# EAGLE design droracer615_104 (EAGLE 9.6.2)
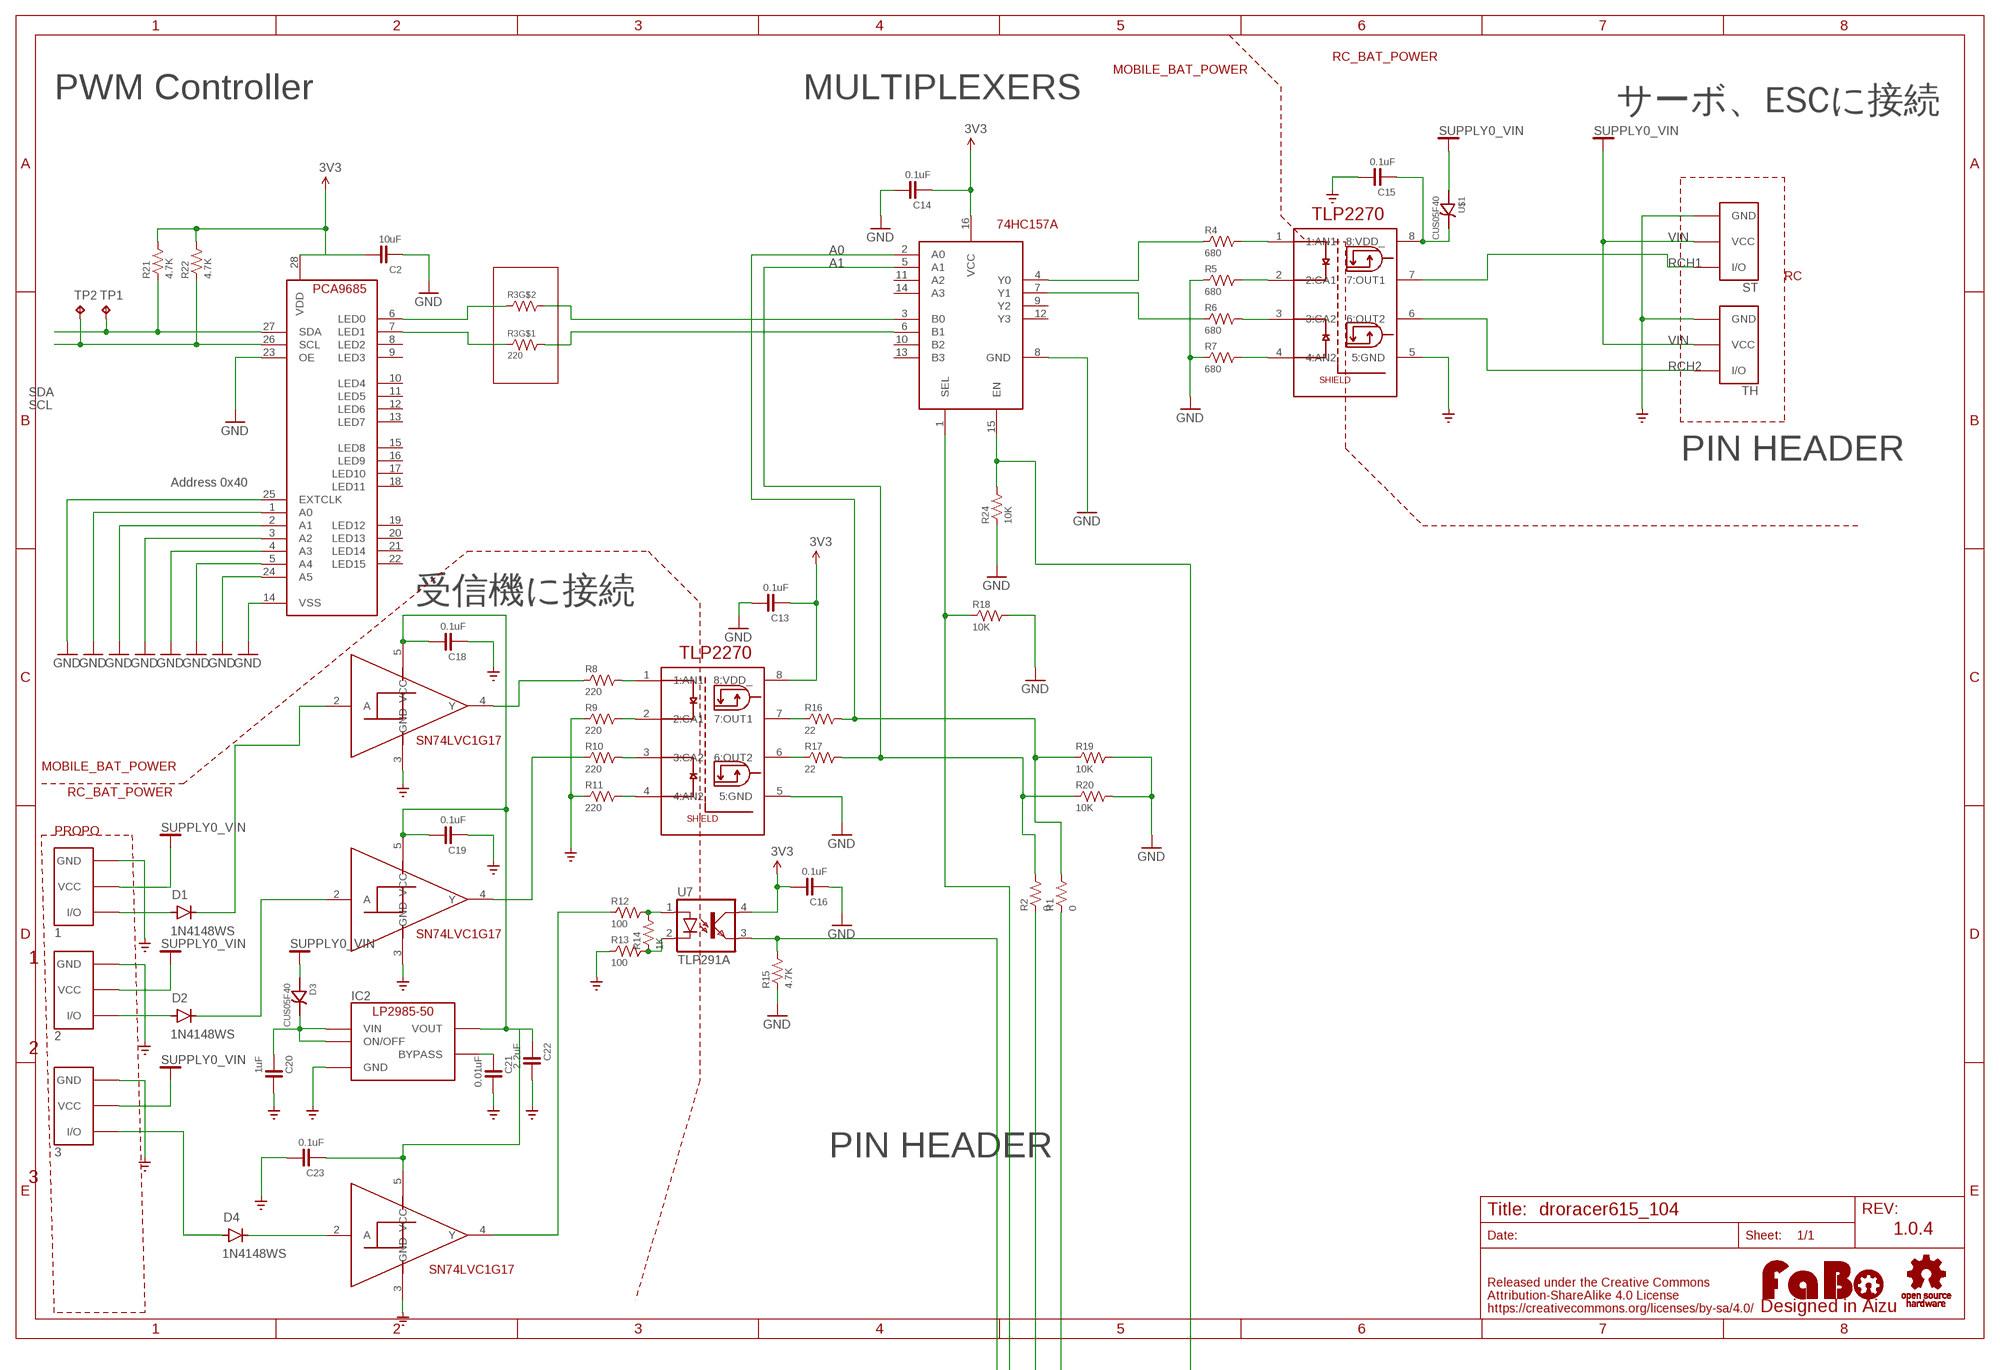
[diagram p0: schematic, sheet 1, part 1 of 2]
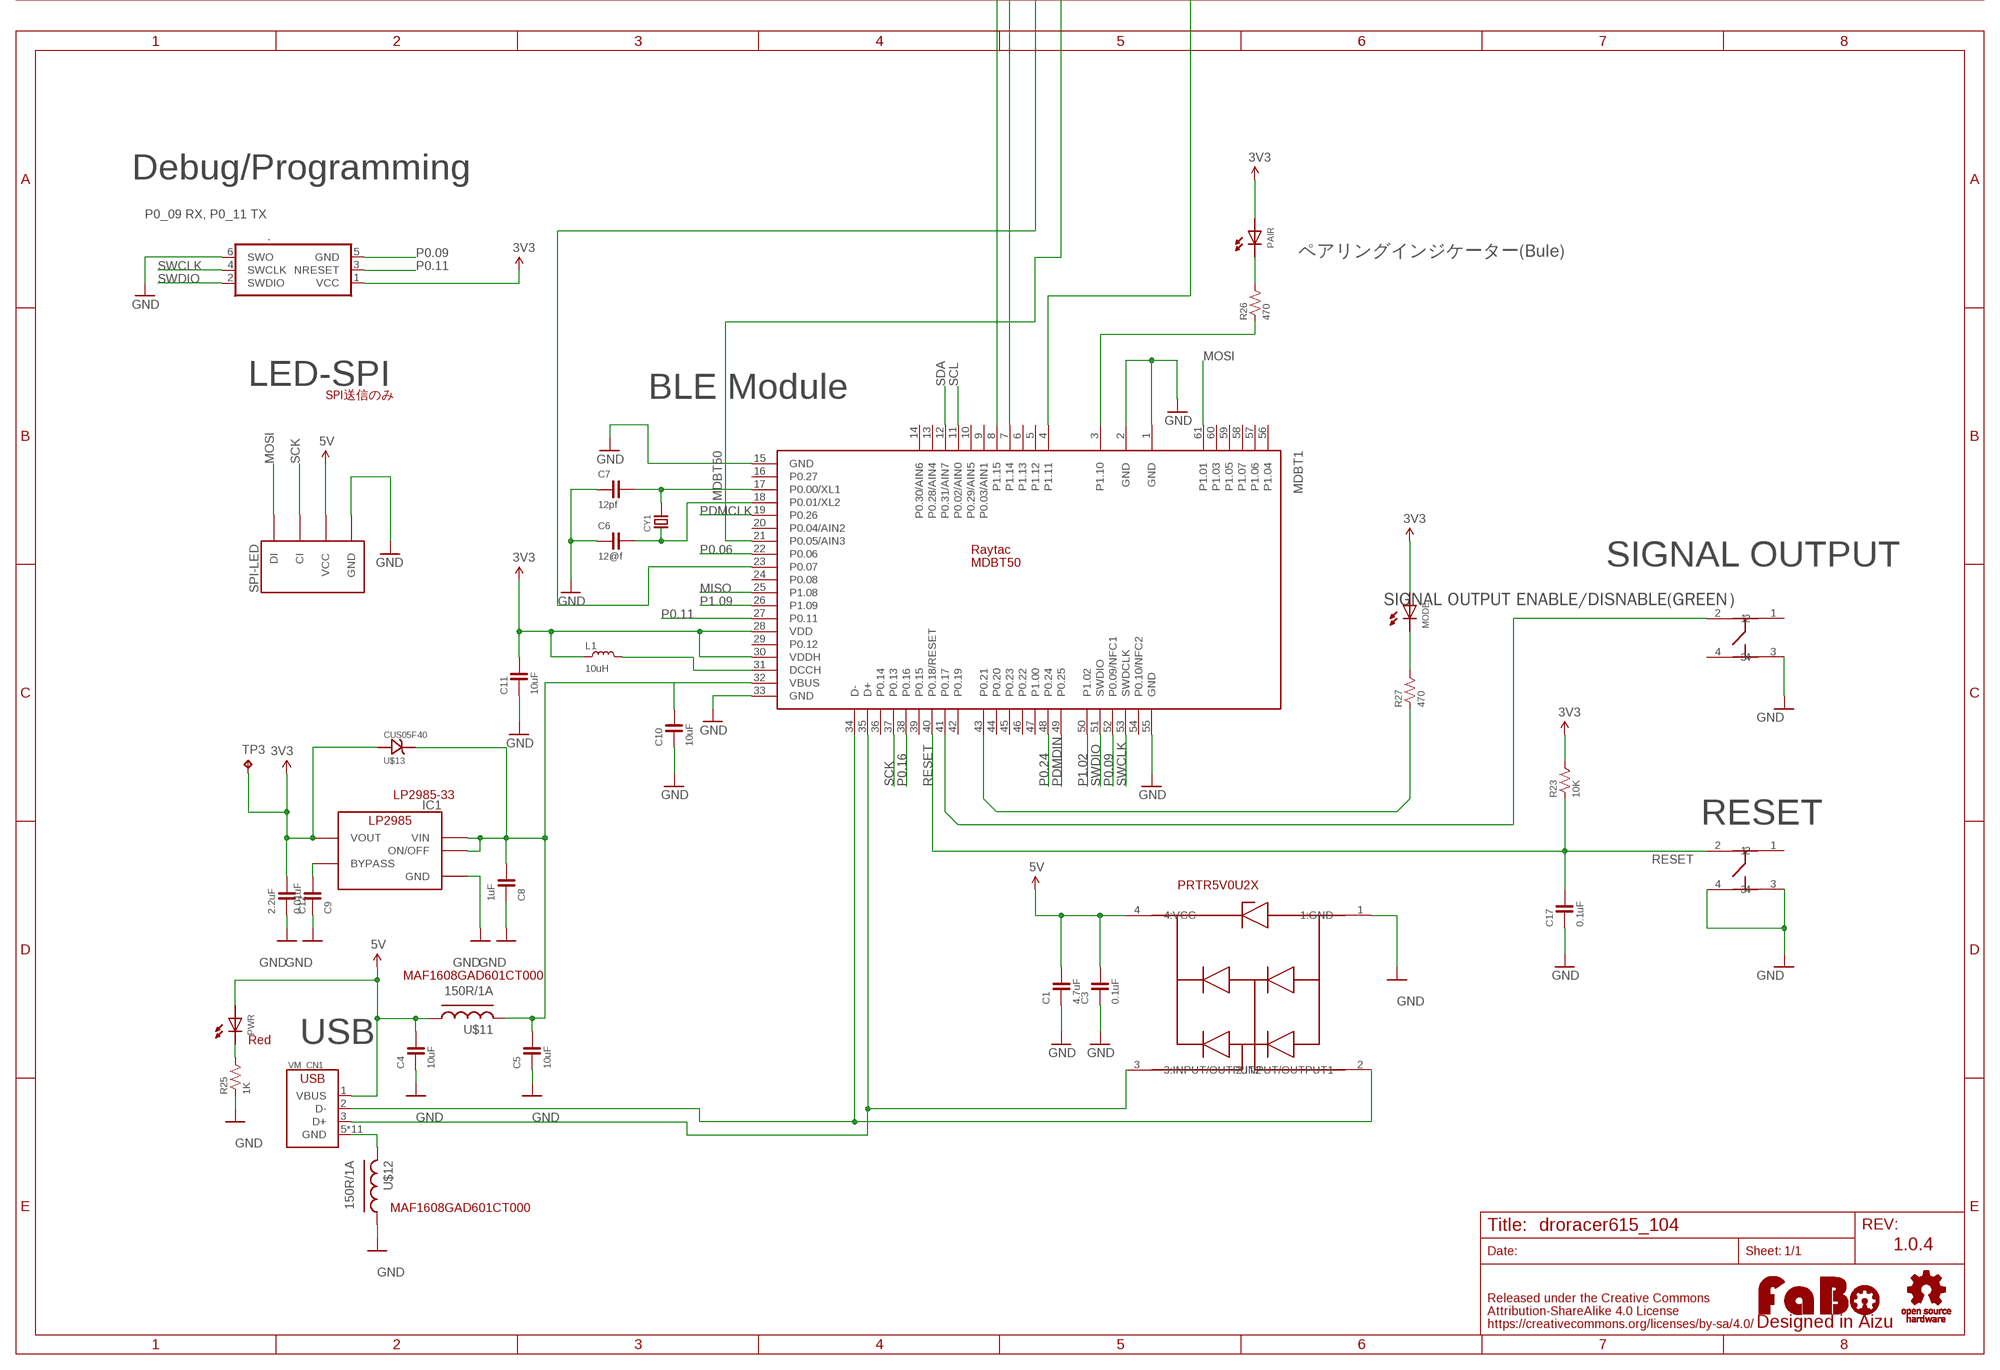
[diagram p1: schematic, sheet 1, part 2 of 2]

## Parts
1  FABO_BRICK_3PIN-HEADER  [FABO_BRICK_3PIN_HEADER]
2  FABO_BRICK_3PIN-HEADER  [FABO_BRICK_3PIN_HEADER]
3  FABO_BRICK_3PIN-HEADER  [FABO_BRICK_3PIN_HEADER]
.  TC2030-IDC-NL  [TC2030-IDC-NL]
C1  4.7uF  CAPACITOR-0603  [0603]
C2  10uF  CAPACITOR-0603  [0603]
C3  0.1uF  CAPACITOR-0603  [0603]
C4  10uF  CAPACITOR-0603  [0603]
C5  10uF  CAPACITOR-0603  [0603]
C6  12@f  CAPACITOR-0603  [0603]
C7  12pf  CAPACITOR-0603  [0603]
C8  1uF  CAPACITOR-0603  [0603]
C9  0.01uF  CAPACITOR-0603  [0603]
C10  10uF  CAPACITOR-0603  [0603]
C11  10uF  CAPACITOR-0603  [0603]
C12  2.2uF  CAPACITOR-0603  [0603]
C13  0.1uF  CAPACITOR-0603  [0603]
C14  0.1uF  CAPACITOR-0603  [0603]
C15  0.1uF  CAPACITOR-0603  [0603]
C16  0.1uF  CAPACITOR-0603  [0603]
C17  0.1uF  CAPACITOR-0603  [0603]
C18  0.1uF  CAPACITOR-0603  [0603]
C19  0.1uF  CAPACITOR-0603  [0603]
C20  1uF  CAPACITOR-0603  [0603]
C21  0.01uF  CAPACITOR-0603  [0603]
C22  2.2uF  CAPACITOR-0603  [0603]
C23  0.1uF  CAPACITOR-0603  [0603]
CY1  CRYSTAL-ABS07  [ABRACON-ABS07-32.768KHZ]
D1  1N4148WS  [SOD-323]
D2  1N4148WS  [SOD-323]
D3  CUS05F40  [CUS05F40]
D4  1N4148WS  [SOD-323]
IC1  LP2985-33DBV  [SOT-23-5]
IC2  LP2985-50  [SOT-23-5]
L1  10uH  COIL-0603  [0603]
LOGO3  LOGO_FABO-S  [LOGO_FABO_S]
MDBT1  MDBT50  [MDBT50]
MODE  LED-0603-NARROW  [0603-NARROW]
PAIR  LED-0603-NARROW  [0603-NARROW]
PWR  LED-0603-NARROW  [0603-NARROW]
R1  0  RESISTOR-0603-NARROW  [0603-NARROW]
R2  0  RESISTOR-0603-NARROW  [0603-NARROW]
R3  220  RESISTOR_ARRAY  [EXBV8V]
R4  680  RESISTOR-0603-NARROW  [0603-NARROW]
R5  680  RESISTOR-0603-NARROW  [0603-NARROW]
R6  680  RESISTOR-0603-NARROW  [0603-NARROW]
R7  680  RESISTOR-0603-NARROW  [0603-NARROW]
R8  220  RESISTOR-0603-NARROW  [0603-NARROW]
R9  220  RESISTOR-0603-NARROW  [0603-NARROW]
R10  220  RESISTOR-0603-NARROW  [0603-NARROW]
R11  220  RESISTOR-0603-NARROW  [0603-NARROW]
R12  100  RESISTOR-0603-NARROW  [0603-NARROW]
R13  100  RESISTOR-0603-NARROW  [0603-NARROW]
R14  1K  RESISTOR-0603-NARROW  [0603-NARROW]
R15  4.7K  RESISTOR-0603-NARROW  [0603-NARROW]
R16  22  RESISTOR-0603-NARROW  [0603-NARROW]
R17  22  RESISTOR-0603-NARROW  [0603-NARROW]
R18  10K  RESISTOR-0603-NARROW  [0603-NARROW]
R19  10K  RESISTOR-0603-NARROW  [0603-NARROW]
R20  10K  RESISTOR-0603-NARROW  [0603-NARROW]
R21  4.7K  RESISTOR-0603-NARROW  [0603-NARROW]
R22  4.7K  RESISTOR-0603-NARROW  [0603-NARROW]
R23  10K  RESISTOR-0603-NARROW  [0603-NARROW]
R24  10K  RESISTOR-0603-NARROW  [0603-NARROW]
R25  1K  RESISTOR-0603-NARROW  [0603-NARROW]
R26  470  RESISTOR-0603-NARROW  [0603-NARROW]
R27  470  RESISTOR-0603-NARROW  [0603-NARROW]
SPI-LED  FABO-SPI-LED  [SPI-B04B-PASK-1_2]
ST  FABO_BRICK_3PIN-HEADER  [FABO_BRICK_3PIN_HEADER]
TH  FABO_BRICK_3PIN-HEADER  [FABO_BRICK_3PIN_HEADER]
TP1  TPB0,65  [B0,65]
TP2  TPB0,65  [B0,65]
TP3  TPB0,65  [B0,65]
U7  TLP291A  [11-3C1]
U$1  CUS05F40  [CUS05F40]
U$2  PCA9685  [PCA9685]
U$3  MULTIPLEXERSMC74HC157A  [TSSOP-16]
U$5  SWICTH-4P(KMR2)  [SWITCH-4P(KMR2)]
U$8  SN74LVC1G17  [SOT-23]
U$10  PRTR5V0U2X  [SOT-143B]
U$11  150R/1A  FERRITECHIPBEADS_0603_M  [RESC0603_M]
U$12  150R/1A  FERRITECHIPBEADS_0603_M  [RESC0603_M]
U$13  CUS05F40  [CUS05F40]
U$14  SN74LVC1G17  [SOT-23]
U$15  TLP2270  [TLP2270]
U$16  TLP2270  [TLP2270]
U$17  SWICTH-4P(KMR2)  [SWITCH-4P(KMR2)]
U$18  SN74LVC1G17  [SOT-23]
U$19  LOGO_OSHW-M_BOTTOM  [LOGO_OSHW_M_BOTTOM]
VM_CN1  USB-ZX62D  [ZX62D-B-5PA8]

## Nets
3V3: ..1(VCC) C2.2 C11.2 C12.2 C13.1 C14.1 C16.2 IC1.5(VOUT) L1.1 MDBT1.28(VDD) MDBT1.30(VDDH) MODE.ANODE PAIR.ANODE R21.2 R22.2 R23.2 TP3.TP U7.4(COL) U$2.28(VDD) U$3.16(VCC) U$13.A(ANODE) U$16.8(8:VDD_)
5V: C1.2 C3.2 C4.2 PWR.ANODE SPI-LED.VCC U$10.4(4:VCC) U$11.1 VM_CN1.1(VBUS)
A0: R1.2 R16.2 R19.1 U$3.2(A0)
A1: R2.2 R17.2 R20.1 U$3.5(A1)
D4: MDBT1.8(P1.15) R15.2 U7.3(EMI)
D+: MDBT1.35(D+) U$10.3(3:INPUT/OUTPUT2) VM_CN1.3(D+)
D-: MDBT1.34(D-) U$10.2(2:INPUT/OUTPUT1) VM_CN1.2(D-)
GND: 1.GND 2.GND 3.GND C15.2 C18.1 C19.1 C20.2 C21.2 C22.2 C23.2 IC2.2(GND) R9.1 R11.1 R13.1 ST.GND TH.GND U$8.3(GND) U$14.3(GND) U$15.5(5:GND) U$18.3(GND) ; supply symbol labelled SUPPLY0_GND_
GND2: ..6(SWO) C1.1 C2.1 C3.1 C4.1 C5.1 C6.1 C7.1 C8.1 C9.1 C10.1 C11.1 C12.1 C13.2 C14.2 C16.1 C17.1 IC1.2(GND) MDBT1.1(GND) MDBT1.2(GND) MDBT1.15(GND) MDBT1.33(GND) MDBT1.55(GND) R5.1 R7.1 R15.1 R18.2 R19.2 R20.2 R24.1 R25.1 SPI-LED.GND U$2.1(A0) U$2.2(A1) U$2.3(A2) U$2.4(A3) U$2.5(A4) U$2.14(VSS) U$2.23(OE) U$2.24(A5) U$2.25(EXTCLK) U$3.8(GND) U$5.3 U$5.4 U$10.1(1:GND) U$12.1 U$16.5(5:GND) U$17.3 ; supply symbol labelled GND
MISO: MDBT1.25(P1.08)
MOSI: MDBT1.61(P1.01) SPI-LED.DI
N$2: R3.2 U$2.6(LED0)
N$3: R3.1 U$2.7(LED1)
N$4: U$12.2 VM_CN1.5(GND) VM_CN1.B1(GND) VM_CN1.B2(GND) VM_CN1.B3(GND) VM_CN1.B4(GND) VM_CN1.T1(GND) VM_CN1.T2(GND) VM_CN1.T3(GND) VM_CN1.T4(GND) VM_CN1.T5(GND) VM_CN1.T6(GND)
N$5: R4.2 U$15.1(1:AN1)
N$6: C9.2 IC1.4(BYPASS)
N$7: C15.1 U$1.C(CATHODE) U$15.8(8:VDD_)
N$8: C5.2 C8.2 C10.2 IC1.1(VIN) IC1.3(ON/OFF) MDBT1.32(VBUS) U$11.2 U$13.C(CATHODE)
N$9: R4.1 U$3.4(Y0)
N$10: D4.C U$8.2(A)
N$11: 3.I/O D4.A
N$12: R12.1 U$8.4(Y)
N$14: R6.1 U$3.7(Y1)
N$15: MDBT1.4(P1.11) R24.2 U$3.15(EN)
N$16: R5.2 U$15.2(2:CA1)
N$17: R6.2 U$15.3(3:CA2)
N$18: R7.2 U$15.4(4:AN2)
N$20: C7.2 CY1.P$2 MDBT1.17(P0.00/XL1)
N$21: C6.2 CY1.P$1 MDBT1.18(P0.01/XL2)
N$22: L1.2 MDBT1.31(DCCH)
N$23: R8.2 U$16.1(1:AN1)
N$24: R9.2 U$16.2(2:CA1)
N$25: R10.2 U$16.3(3:CA2)
N$26: R11.2 U$16.4(4:AN2)
N$27: D1.C U$18.2(A)
N$28: R10.1 U$14.4(Y)
N$29: R8.1 U$18.4(Y)
N$30: R12.2 R14.2 U7.1(A)
N$31: R13.2 R14.1 U7.2(C)
N$32: R16.1 U$16.7(7:OUT1)
N$33: R17.1 U$16.6(6:OUT2)
N$34: MDBT1.21(P0.05/AIN3) R1.1
N$35: MDBT1.7(P1.14) R18.1 U$3.1(SEL)
N$36: PWR.CATHODE R25.2
N$37: R3.7 U$3.3(B0)
N$38: R3.8 U$3.6(B1)
N$39: PAIR.CATHODE R26.2
N$40: MDBT1.3(P1.10) R26.1
N$41: MODE.CATHODE R27.2
N$42: MDBT1.41(P0.17) U$17.2
N$43: MDBT1.43(P0.21) R27.1
N$44: MDBT1.23(P0.07) R2.1
N$45: 1.I/O D1.A
N$46: 2.I/O D2.A
N$47: D2.C U$14.2(A)
N$49: C21.1 IC2.4(BYPASS)
N$50: C20.1 D3.C(CATHODE) IC2.1(VIN) IC2.3(ON/OFF)
N$51: C18.2 C19.2 C22.1 C23.1 IC2.5(VOUT) U$8.5(VCC) U$14.5(VCC) U$18.5(VCC)
P0.06: MDBT1.22(P0.06)
P0.09: ..5(GND) MDBT1.52(P0.09/NFC1)
P0.11: ..3(NRESET) MDBT1.27(P0.11)
P0.16: MDBT1.38(P0.16)
P0.24: MDBT1.48(P0.24)
P1.02: MDBT1.50(P1.02)
P1.09: MDBT1.26(P1.09)
PDMCLK: MDBT1.19(P0.26)
PDMDIN: MDBT1.49(P0.25)
RCH1: ST.I/O U$15.7(7:OUT1)
RCH2: TH.I/O U$15.6(6:OUT2)
RESET: C17.2 MDBT1.40(P0.18/RESET) R23.1 U$5.2
SCK: MDBT1.37(P0.13) SPI-LED.CI
SCL: MDBT1.11(P0.02/AIN0) R22.1 TP2.TP U$2.26(SCL)
SDA: MDBT1.12(P0.31/AIN7) R21.1 TP1.TP U$2.27(SDA)
SWCLK: ..4(SWCLK) MDBT1.53(SWDCLK)
SWDIO: ..2(SWDIO) MDBT1.51(SWDIO)
VIN: 1.VCC 2.VCC 3.VCC D3.A(ANODE) ST.VCC TH.VCC U$1.A(ANODE) ; supply symbol labelled SUPPLY0_VIN
Unconnected: MDBT1.5(P1.12) MDBT1.6(P1.13) MDBT1.9(P0.03/AIN1) MDBT1.10(P0.29/AIN5) MDBT1.13(P0.28/AIN4) MDBT1.14(P0.30/AIN6) MDBT1.16(P0.27) MDBT1.20(P0.04/AIN2) MDBT1.24(P0.08) MDBT1.29(P0.12) MDBT1.36(P0.14) MDBT1.39(P0.15) MDBT1.42(P0.19) MDBT1.44(P0.20) MDBT1.45(P0.23) MDBT1.46(P0.22) MDBT1.47(P1.00) MDBT1.54(P0.10/NFC2) MDBT1.56(P1.04) MDBT1.57(P1.06) MDBT1.58(P1.07) MDBT1.59(P1.05) MDBT1.60(P1.03) R3.3 R3.4 R3.5 R3.6 U$2.8(LED2) U$2.9(LED3) U$2.10(LED4) U$2.11(LED5) U$2.12(LED6) U$2.13(LED7) U$2.15(LED8) U$2.16(LED9) U$2.17(LED10) U$2.18(LED11) U$2.19(LED12) U$2.20(LED13) U$2.21(LED14) U$2.22(LED15) U$3.9(Y2) U$3.10(B2) U$3.11(A2) U$3.12(Y3) U$3.13(B3) U$3.14(A3) U$5.1 U$17.1 U$17.4

## Notes on the sheet
- RC_BAT_POWER
- MOBILE_BAT_POWER
- PWM Controller | MULTIPLEXERS
- サーボ、ESCに接続
- 74HC157A
- RC
- PIN HEADER
- Address 0x40
- 受信機に接続
- SN74LVC1G17
- MOBILE_BAT_POWER
- RC_BAT_POWER
- PROPO
- SN74LVC1G17
- 1
- 2
- PIN HEADER
- 3
- 1.0.4
- SN74LVC1G17
- Debug/Programming
- P0_09 RX, P0_11 TX
- ペアリングインジケーター(Bule)
- LED-SPI
- SPI送信のみ | BLE Module
- Raytac
- MDBT50 | SIGNAL OUTPUT
- SIGNAL OUTPUT ENABLE/DISNABLE(GREEN）
- LP2985-33
- RESET
- PRTR5V0U2X
- MAF1608GAD601CT000
- Red | USB
- MAF1608GAD601CT000
- 1.0.4

## Library data of the parts
1-3 ST TH = FaBo-Template:FABO_BRICK_3PIN: FaBo Brick 3pin
. = TagConnect:TC2030-IDC: Tag-Connect In Circuit Programming & Debug Cable 6 Pin http://www.tag-connect.com
C1-C23 = FaBo-Capacitor:CAPACITOR: CAPACITOR
CY1 = FaBo-Crystal:CRYSTAL
D1 D2 D4 = Diodes:1N4148WS: DIODE GEN PURP 75V 150MA SOD323F Manufacturer's datasheet <https://www.onsemi.com/pub/Collateral/1N914BWS-D.pdf>; CREATED_BY: PCBLayout.com; DIGIKEY_PART_NUMBER: 1N4148WSFSTR-ND; MANUFACTURER: Diodes Incorporated; MPN: 1N4148WS; PACKAGE: SOD-323
D3 U$1 U$13 = FaBo-Diode:CUS05F40
IC1 = FaBo-Supply:LP2985: LP2985
IC2 = FaBo-Supply:LP2985-50
L1 = FaBo-Coil:COIL: RESISTOR
LOGO3 = component:LOGO_FABO
MDBT1 = MDBT50Q_171031:MDBT50: Raytac Corporation MDBT50 Bluetooth Low Energy Module based on Noridc nRF52840 Source: Raytac datasheet
MODE PAIR PWR = FaBo-LED:LED
R1 R2 R4-R27 = FaBo-Resistors:RESISTOR: RESISTOR
R3 = component:RESISTOR_ARRAY
SPI-LED = FaBo-Connetor:FABO-SPI-LED
TP1-TP3 = BeagleBone_Blue_R3:TP: Test pad
U7 = FaBo_Photocoupler:TLP291A; SPICEPREFIX: E
U$2 = FaBo-Motor:PCA9685
U$3 = FaBo-Multiplexers:MULTIPLEXERS
U$5 U$17 = gclue-test:SWICTH-4P(KMR2)
U$8 U$14 U$18 = FaBo-LogicIC:SN74LVC1G17
U$10 = FaBo-Diode:PRTR5V0U2X
U$11 U$12 = FaBo-Coil:FERRITECHIPBEADS: Generic chip inductor
U$15 U$16 = FaBo_Photocoupler:TLP2270
U$19 = FaBo-Logo:LOGO_OSHW
VM_CN1 = component:USB

## Net classes
2 gnd: width 0.254 mm, drill 0.61 mm, clearance 0.254 mm
3 usbvcc: width 0.254 mm, drill 0.61 mm, clearance 0.254 mm
4 aref: width 0.254 mm, drill 0.61 mm, clearance 0.254 mm

## Board
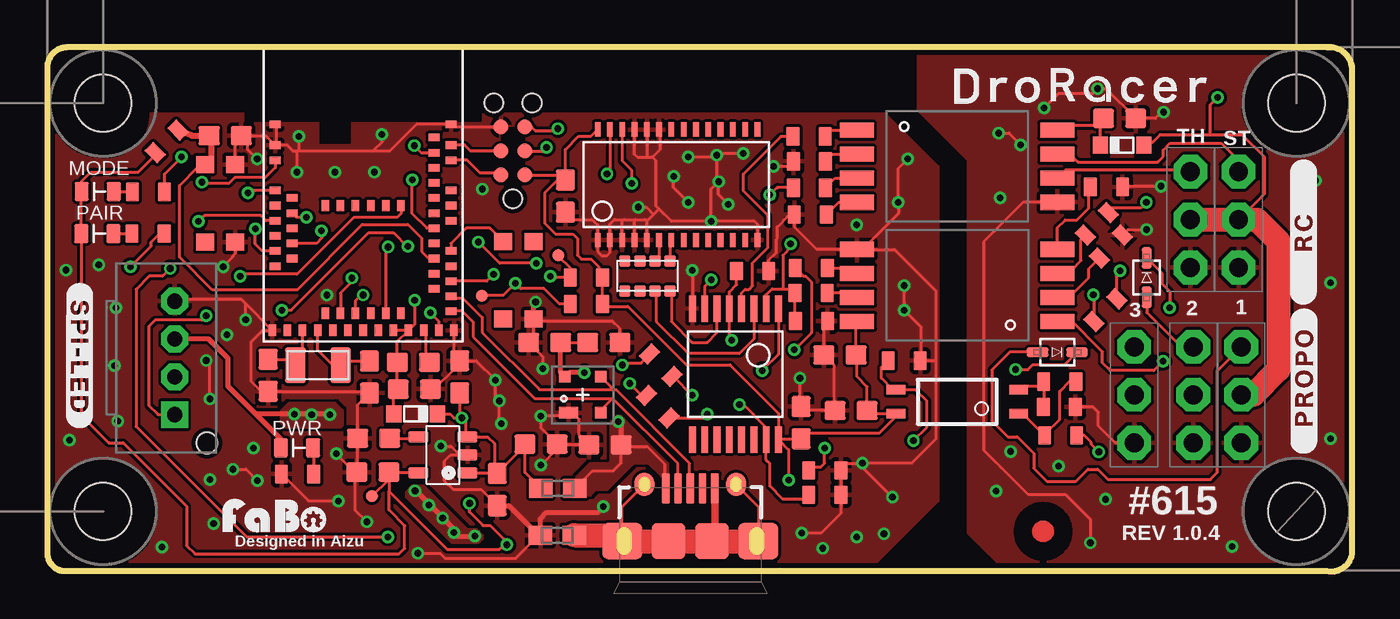
[diagram p2: board, top side]
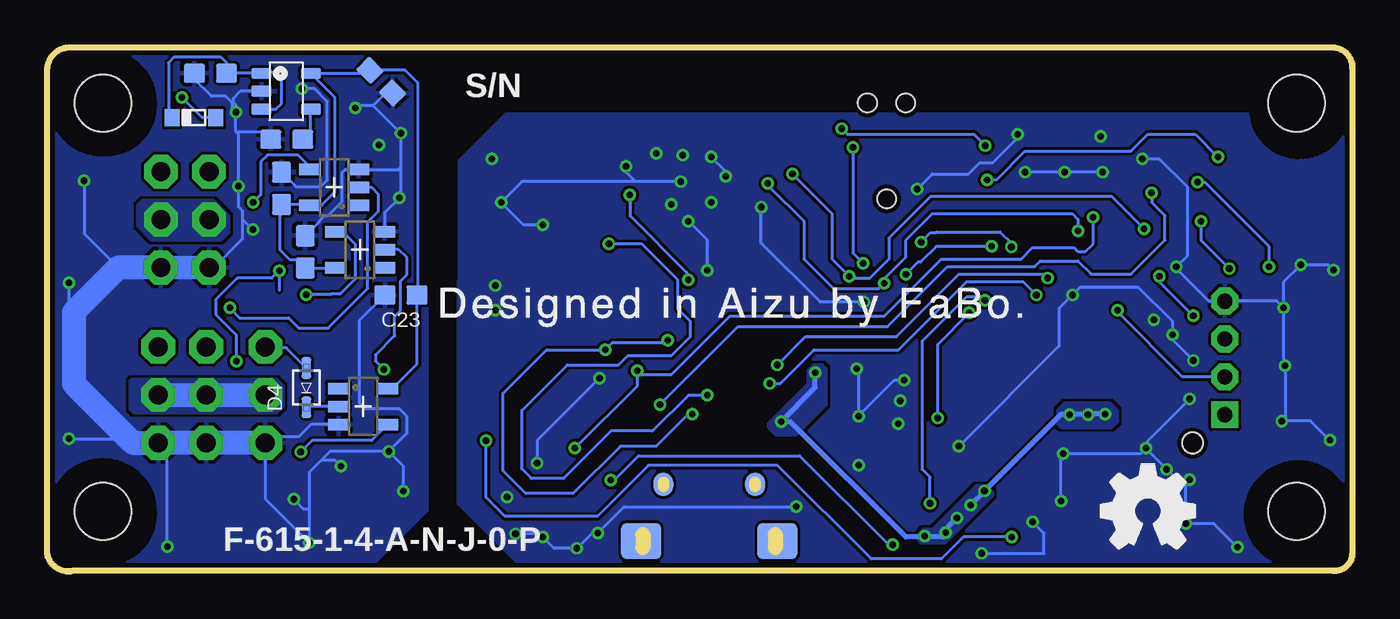
[diagram p3: board, bottom side, seen from below]

Size 69 x 27.73 mm. Coordinates in mm from the lower left corner, seen from the top.
Outline: 1.01,0.02 67.67,0.02 arc90 69,0.91 69,26.63 arc90 67.67,27.72 1.01,27.72 arc90 0,26.63 0,0.91 arc90 1.01,0.02
Copper layers (1*16): Top 0.035mm / dielectric 1.6mm / Bottom 0.035mm
Design rules "PCBway": minimum track width 6mil, minimum drill 12mil, track to track 6mil, track to pad 6mil, pad to pad 6mil, via to via 6mil, smd to smd 6mil, copper to edge 10mil, drill to drill 10mil, minimum pad ring 10mil, minimum via ring 6mil, stop-mask expansion 2mil, vias tented up to drill 100mil, thermal gap 8mil
Holes 3 mm at 2.95,24.77 2.95,3.18 66.05,3.18 66.05,24.77
tRestrict: area 5.3,24.3 to 44.4,29.1; area 0.1,21.9 to 5.3,27.5; area 0.1,0.3 to 5.7,5.9; area 63.3,0.4 to 68.8,6; area 63.2,22 to 68.8,27.5
bRestrict: area 5.6,24.3 to 44.7,29.1; area 0.1,0.3 to 5.7,5.8; area 0.2,21.9 to 5.4,27.4; area 63.3,22 to 68.9,27.6; area 63.3,0.4 to 68.9,5.9

### Footprints (pad centres in the part's own frame; a part is rotated, then mirrored left to right if it is on the bottom)
FABO_BRICK_3PIN_HEADER = drill 1 pad 1.778 octagon: GND -2.54,0; I/O 2.54,0; VCC 0,0
TC2030-IDC-NL = smd 0.787 x 0.787: 1 -1.27,-0.635; 2 -1.27,0.635; 3 0,-0.635; 4 0,0.635; 5 1.27,-0.635; 6 1.27,0.635 | hole 0.991: -2.54,0; 2.54,1.016; 2.54,-1.016
0603 = smd 1.1 x 1: 1 -0.85,0; 2 0.85,0
ABRACON-ABS07-32.768KHZ = smd 1.1 x 1.9: P$1 -1.2,0; P$2 1.2,0
SOD-323 = smd 1.14 x 0.52: A 1.04,0; C -1.04,0
CUS05F40 = smd 0.8 x 0.9: A -1.15,0; C 1.15,0
SOT-23-5 = smd 0.6 x 1.05: 1 -0.95,-1.3; 2 0,-1.3; 3 0.95,-1.3; 4 0.95,1.3; 5 -0.95,1.3
MDBT50 = smd 0.6 x 0.4: 1 -4.65,3.75; 2 -4.65,2.65; 3 -4.65,1.85; 4 -4.65,0.25; 5 -3.75,-0.15; 6 -4.65,-0.55; 7 -3.75,-0.95; 8 -4.65,-1.35; 9 -3.75,-1.75; 10 -4.65,-2.15; 11 -3.75,-2.55; 12 -4.65,-2.95; 13 -3.75,-3.35; 14 -4.65,-3.75; 34 4.65,-6.15; 35 4.65,-5.35; 36 3.75,-4.95; 37 4.65,-4.55; 38 3.75,-4.15; 39 4.65,-3.75; 40 3.75,-3.35; 41 4.65,-2.95; 42 3.75,-2.55; 43 3.75,-1.75; 44 4.65,-1.35; 45 3.75,-0.95; 46 4.65,-0.55; 47 3.75,-0.15; 48 4.65,0.25; 49 3.75,0.65; 50 3.75,1.45; 51 4.65,1.85; 52 3.75,2.25; 53 4.65,2.65; 54 3.75,3.05; 55 4.65,3.75 | smd 0.4 x 0.6: 15 -4.8,-7.15; 16 -4,-7.15; 17 -3.2,-7.15; 18 -2.4,-7.15; 19 -2,-6.25; 20 -1.6,-7.15; 21 -1.2,-6.25; 22 -0.8,-7.15; 23 -0.4,-6.25; 24 0,-7.15; 25 0.4,-6.25; 26 0.8,-7.15; 27 1.2,-6.25; 28 1.6,-7.15; 29 2,-6.25; 30 2.4,-7.15; 31 3.2,-7.15; 32 4,-7.15; 33 4.8,-7.15; 56 -2,-0.55; 57 -1.2,-0.55; 58 -0.4,-0.55; 59 0.4,-0.55; 60 1.2,-0.55; 61 2,-0.55
0603-NARROW = smd 0.75 x 1: ANODE -0.85,0; CATHODE 0.85,0
0603-NARROW' = smd 0.71 x 1: 1 -0.85,0; 2 0.85,0
EXBV8V = smd 0.6 x 0.6: 1 -1.2,-0.8; 2 -0.4,-0.8; 3 0.4,-0.8; 4 1.2,-0.8; 5 1.2,0.8; 6 0.4,0.8; 7 -0.4,0.8; 8 -1.2,0.8
SPI-B04B-PASK-1_2 = drill 0.8 pad 1.422 octagon: CI 1,1.27; GND -3,1.27; VCC -1,1.27 | drill 0.8 pad 1.422 square: DI 3,1.27 | hole 1.1: 4.5,2.97
B0,65 = smd 0.635 x 0.635: TP 0,0
11-3C1 = smd 1 x 0.5: 1 -3.24,0.635; 2 -3.24,-0.635; 3 3.24,-0.635; 4 3.24,0.635
PCA9685 = smd 0.3 x 0.75: 1 -4.15,-2.93; 2 -3.5,-2.93; 3 -2.85,-2.93; 4 -2.2,-2.93; 5 -1.55,-2.93; 6 -0.9,-2.93; 7 -0.25,-2.93; 8 0.4,-2.93; 9 1.05,-2.93; 10 1.7,-2.93; 11 2.35,-2.93; 12 3,-2.93; 13 3.65,-2.93; 14 4.3,-2.93; 15 4.3,2.92; 16 3.65,2.92; 17 3,2.92; 18 2.35,2.92; 19 1.7,2.92; 20 1.05,2.92; 21 0.4,2.92; 22 -0.25,2.92; 23 -0.9,2.92; 24 -1.55,2.92; 25 -2.2,2.92; 26 -2.85,2.92; 27 -3.5,2.92; 28 -4.15,2.92
TSSOP-16 = smd 0.36 x 1.397: 1 -2.275,-3.469; 2 -1.625,-3.469; 3 -0.975,-3.469; 4 -0.325,-3.469; 5 0.325,-3.469; 6 0.975,-3.469; 7 1.625,-3.469; 8 2.271,-3.469; 9 2.275,3.458; 10 1.625,3.458; 11 0.971,3.458; 12 0.325,3.458; 13 -0.325,3.458; 14 -0.975,3.458; 15 -1.625,3.458; 16 -2.275,3.458
SWITCH-4P(KMR2) = smd 0.9 x 0.95: 1 -1,0; 2 3.1,0; 3 -1,-1.6; 4 3.1,-1.6
SOT-23 = smd 1.1 x 0.6: 1 -1.3,0.95; 2 -1.3,0; 3 -1.3,-0.95; 4 1.3,-0.95; 5 1.3,0.95
SOT-143B = smd 1 x 0.6: 1 -0.75,-0.95 | smd 0.6 x 0.6: 2 0.95,-0.95; 3 0.95,0.95; 4 -0.95,0.95
RESC0603_M = smd 1.25 x 1: 1 -0.9,0; 2 0.9,0
TLP2270 = smd 0.8 x 1.8: 1 -1.905,-5.3; 2 -0.635,-5.3; 3 0.635,-5.3; 4 1.905,-5.3; 5 1.905,5.3; 6 0.635,5.3; 7 -0.635,5.3; 8 -1.905,5.3
ZX62D-B-5PA8 = smd 0.4 x 1.6: 1 -1.3,4.25; 2 -0.65,4.25; 3 0,4.25; 4 0.65,4.25; 5 1.3,4.25 | smd 1.05 x 1.25 bottom: B1 -2.425,4.45; B2 2.425,4.45 | smd 2.1 x 1.9 bottom: B3 -3.6,1.45; B4 3.6,1.45 | smd 1.05 x 1.25: T1 -2.425,4.45; T2 2.425,4.45 | smd 2.1 x 1.9: T3 -3.6,1.45; T6 3.6,1.45 | smd 1.8 x 1.9: T4 -1.15,1.45; T5 1.15,1.45

### Placement (x,y rotation side)
1  63.13,9.34 90 top
2  60.59,9.34 90 top
3  57.47,9.34 90 top
.  24.62,22.24 90 top
C1  29.42,12.11 180 top
C2  27.39,19.85 90 top
C3  26.3,12.11 0 top
C4  29.49,6.7 0 top
C5  26.11,6.73 180 top
C6  17.04,10.28 90 top
C7  11.68,10.37 90 top
C8  23.79,4.33 90 top
C9  17.26,7.04 0 top
C10  21.81,10.29 270 top
C11  19.41,9.64 180 top
C12  17.22,5.25 0 top
C13  42.5,8.51 180 top
C14  39.86,7.87 90 top
C15  56.7,23.96 0 top
C16  41.91,11.45 0 top
C17  9.41,23.05 180 top
C18  55.36,16.9 270 bottom
C19  56.61,20.26 270 bottom
C20  60.37,26.35 180 bottom
C21  56.34,22.86 180 bottom
C22  51.34,25.91 315 bottom
C23  50.3,14.62 180 bottom
CY1  14.32,10.91 180 top
D1  53.4,11.6 180 top
D2  58.13,15.54 270 top
D3  61.24,24 180 bottom
D4  55.3,9.72 90 bottom
IC1  20.92,6.16 90 top
IC2  56.37,25.39 270 bottom
L1  19.36,11.06 0 top
LOGO3  12.06,1.93 0 top
MDBT1  16.7,19.9 0 top
MODE  2.67,20.1 0 top
PAIR  2.65,17.86 0 top
PWR  13.2,6.54 0 top
R1  0  [0603-NARROW']  32.44,10.91 315 top
R2  0  [0603-NARROW']  32.28,8.71 315 top
R3  31.73,15.63 180 top
R4  680  [0603-NARROW']  40.28,23.01 0 top
R5  680  [0603-NARROW']  40.3,21.69 0 top
R6  680  [0603-NARROW']  40.3,20.29 0 top
R7  680  [0603-NARROW']  40.35,18.87 0 top
R8  220  [0603-NARROW']  55.95,13.82 45 top
R9  220  [0603-NARROW']  56.24,17.19 225 top
R10  220  [0603-NARROW']  55.5,18.39 225 top
R11  220  [0603-NARROW']  56,20.34 180 top
R12  100  [0603-NARROW']  53.58,7.19 180 top
R13  100  [0603-NARROW']  53.52,8.7 180 top
R14  1K  [0603-NARROW']  53.54,10.04 0 top
R15  4.7K  [0603-NARROW']  45.31,11.15 180 top
R16  22  [0603-NARROW']  40.39,14.72 180 top
R17  22  [0603-NARROW']  40.4,16.05 180 top
R18  10K  [0603-NARROW']  41.11,5.35 0 top
R19  10K  [0603-NARROW']  40.41,13.25 0 top
R20  10K  [0603-NARROW']  37.29,15.89 0 top
R21  4.7K  [0603-NARROW']  28.51,15.55 0 top
R22  4.7K  [0603-NARROW']  28.51,14.15 0 top
R23  10K  [0603-NARROW']  6.31,22.75 225 top
R24  10K  [0603-NARROW']  41.11,4.05 180 top
R25  1K  [0603-NARROW']  13.24,5.15 0 top
R26  470  [0603-NARROW']  5.33,17.87 180 top
R27  470  [0603-NARROW']  5.35,20.08 180 top
SPI-LED  5.47,11.29 270 top
ST  62.99,18.61 90 top
TH  60.45,18.61 90 top
TP1  27.02,16.72 0 top
TP2  22.97,14.58 0 top
TP3  17.18,3.98 0 top
U7  48.12,8.97 180 top
U$1  56.83,22.56 180 top
U$2  33.25,20.46 0 top
U$3  36.39,10.43 180 top
U$4  [MARK_POINT_3MM]  52.65,2.12 0 top
U$5  8.34,18.42 90 top
U$8  52.3,8.72 0 bottom
U$10  28.31,9.34 0 top
U$11  27,4.39 180 top
U$12  26.97,1.91 0 top
U$13  19.47,8.33 0 top
U$14  53.83,20.32 180 bottom
U$15  48.11,21.43 270 top
U$16  48.12,15.13 90 top
U$17  24.1,14.36 90 top
U$18  52.47,17.02 180 bottom
U$19  10.79,3.2 0 top
VM_CN1  34,0.15 0 top

### Tracks (layer width: path | path; a pad name or v marks a point on that pad's centre or on a via)
3V3  (via drill 0.35)
  Top 0.152: IC1.5 19.58,5.25 C12.2 18.07,4.88 | 18.07,4.88 18.07,4.24 | MDBT1.30 19.42,13.07 v19.42,14.34 | MDBT1.30 MDBT1.28 | MDBT1.30 18.51,12.16 L1.1 18.51,9.79 18.64,9.66 18.59,9.61 | C11.2 18.59,9.61 | U$13.A 18.32,9.34 18.59,9.61 | U7.4 44.8,8.34 | 44.8,8.34 43.78,8.34 43.48,8.64 C13.1 43.35,9.77 42.8,10.32 42.8,11.41 C16.2 42.76,13.17 U$16.8 | U$3.16 38.71,7.02 C14.1 40.16,7.32 44,7.32 44.8,8.12 44.8,8.34 | 27.39,20.72 C2.2 26.98,20.7 26.3,20.02 26.3,18.42 26.88,17.84 27.8,17.84 28.03,17.61 28.03,16.72 28.24,16.51 28.76,16.51 29.17,16.1 29.17,15.55 R21.2 R22.2 29.49,14.02 30.7,14.02 33.8,10.92 36.1,10.92 38.66,8.36 U$3.16 | 27.39,20.72 27.39,22.32 28.1,23.02 28.74,23.02 U$2.28 | ..1 27.14,20.97 27.39,20.72 | U$3.16 39.2,6.43 v39.2,4.82 | R23.2 5.71,22.03 4.8,21.12 2.3,21.12 1.82,20.64 MODE.ANODE 1.8,20.08 PAIR.ANODE 1.8,8.26 3.25,6.8 4.01,6.8 7.37,3.44 7.37,1.36 7.81,0.92 18.6,0.92 18.9,1.22 18.9,2.42 18.07,3.25 18.07,4.24 | 18.07,4.24 21.13,1.18 23.91,1.18 24.14,1.41 24.16,1.41 | v22.33,3.6 22.33,3.15 23.04,2.43 23.42,2.43 24.16,1.7 24.16,1.41 | 24.16,1.41 v24.31,1.41 | TP3.TP 18.07,4.88
  Bottom 0.152: v19.42,14.34 19.62,14.54 20.38,14.54 22.73,12.19 22.73,5.39 22.33,4.99 v22.33,3.6 | v39.2,4.82 39.03,4.82 37.73,6.12 29.21,6.12 24.5,1.41 v24.31,1.41
5V  (via drill 0.35)
  Top 0.152: VM_CN1.1 32.66,4.44 32.66,5.67 31.75,6.58 30.34,6.58 | U$11.1 28.82,5.31 29.92,5.31 30.34,5.73 30.34,6.58 | 30.34,6.58 30.34,6.62 C4.2 | C3.2 C1.2
  Top 0.254: PWR.ANODE 12.35,7 11,8.35 | 11,8.35 14.88,8.35 v14.94,8.29 | v19.45,4.26 19.49,4.26 20.9,2.85 v20.9,2.82 21.5,2.22 v21.5,2.05 21.69,1.87 v22.6,1.87 | v30.2,7.92 30.34,7.78 30.34,6.62 | v28.4,10.52 27.59,10.52 U$10.4 27.15,10.5 C3.2 | 11,8.35 9.56,9.79 9.56,11.28 8.54,12.29 SPI-LED.VCC
  Bottom 0.254: v20.9,2.82 21.4,2.32 21.4,2.02 21.6,1.82 23.6,1.82 29.7,7.92 v30.2,7.92 28.4,9.72 v28.4,10.52 | v13.08,8.32 13.95,8.32 v13.97,8.29 v14.94,8.29 15.41,8.29 v19.45,4.26 19.45,4.25 v20.18,3.51
  pour Top (no thermals): 12.4,7.82 12.4,8.52 12.8,8.92 15.2,8.92 15.6,8.52 15.6,8.42 15.6,7.72 15.5,7.62 12.6,7.62
  pour Bottom (no thermals): 12.4,7.92 12.4,8.52 12.8,8.92 15.2,8.92 15.6,8.52 15.6,8.42 15.6,7.82 15.4,7.62 12.7,7.62
  pour Top (no thermals): 19,3.92 19,4.22 19.3,4.52 19.7,4.52 19.9,4.52 21.4,3.02 22.2,2.22 22.7,2.22 23,1.92 23,1.82 23,1.72 22.8,1.52 21.4,1.52
  pour Bottom (no thermals): 19,4.02 19,4.22 19.3,4.52 19.9,4.52 22.2,2.22 22.7,2.22 23,1.92 23,1.72 22.8,1.52 21.5,1.52
  pour Bottom (no thermals): 27.8,8.82 27.8,10.72 28,10.92 28.3,10.92 28.5,10.92 28.8,10.62 28.8,9.92 30.5,8.22 30.9,7.82 30.9,7.72 30.9,7.62 30.5,7.22 29.4,7.22
  pour Top (no thermals): 28.2,4.62 28,4.82 28,5.02 28.7,5.72 29.1,5.72 29.7,5.72 29.8,5.82 29.8,6.22 29.8,7.92 30.1,8.22 30.3,8.22 32.8,5.72 32.8,5.22 32.8,5.12 32.7,5.02 32.5,5.02 32.4,5.12 31.9,5.62 31.8,5.72 31,5.72 29.6,4.32 29,4.32 28.7,4.02 28.6,4.02 28.2,4.42
A0  (via drill 0.35)
  Top 0.152: U$3.2 38,14.62 38.32,14.94 38.9,14.94 | 38.9,14.94 39.32,14.94 R16.2 39.54,13.27 R19.1 | R1.2 33.11,10.31 v34.1,9.32 | v39.3,17.32 39.3,17.12 38.9,16.72 38.9,14.94
  Bottom 0.152: v34.1,9.32 35.1,9.32 37,7.42 39.2,7.42 41.7,4.92 43.4,4.92 43.9,5.42 43.9,8.52 41.5,10.92 38.8,10.92 38.3,11.42 36,11.42 35,12.42 35,13.22 35.66,13.88 35.66,15.42 37.56,17.32 v39.3,17.32
A1  (via drill 0.35)
  Top 0.152: 39.35,16.25 R17.2 39.98,15.62 40.1,15.62 40.4,15.32 40.4,12.62 v39.5,11.72 | v36.2,12.22 36.06,12.36 U$3.5 36.06,14.78 36.45,15.17 R20.1 | R2.2 34.69,8.11 v34.9,8.32
  Bottom 0.152: v36.2,12.22 36.3,12.12 39.1,12.12 v39.5,11.72 42.6,11.72 44.9,9.42 44.9,5.32 43.7,4.12 41.2,4.12 38.7,6.62 36.8,6.62 35.1,8.32 v34.9,8.32
D4  (via drill 0.35)
  Top 0.152: R15.2 44.1,10.79 44.1,10.22 44.72,9.61 U7.3 45.91,9.61 46.5,9.02 46.5,7.62 v45.8,6.92 | MDBT1.8 11.57,18.55 11.3,18.82 8.3,18.82 v8,18.52 | v6.5,16.02 6.1,15.62 5.4,15.62 4.7,14.92 4.7,7.67 10.55,1.82 v18,1.82
  Bottom 0.152: v8,18.52 8,17.52 v6.5,16.02 | v18,1.82 20.55,1.82 21.72,0.65 25.43,0.65 30.4,5.62 37.21,5.62 39.91,2.92 44.8,2.92 45.8,3.92 v45.8,6.92
D+
  Top 0.152: VM_CN1.3 33.97,4.43 33.97,5.71 30.06,9.62 29.8,9.62 | 29.8,9.62 26.02,9.62 23,12.64 23,13.44 21.97,14.47 21.43,14.47 MDBT1.35 | U$10.3 29.8,9.75 29.8,9.62
D-
  Top 0.152: VM_CN1.2 33.35,5.71 29.9,9.16 | MDBT1.34 21.38,13.78 21.92,13.78 22.52,13.18 22.52,12.4 25.76,9.16 29.9,9.16 | U$10.2 29.26,8.52 29.9,9.16
GND  (via drill 0.35)
  Top 0.152: U$15.5 51.6,19.53 49.5,17.42 49.5,6.42 51.85,4.07 53.83,4.07 55.15,2.74 v55.15,1.52 | 56.85,20.03 R11.1 56.89,20.38 v58.89,20.38 | v59.03,24.29 58.93,24.29 58.6,23.96 C15.2 55.98,25.53 v55.54,25.53 55.27,25.26 53.45,25.26 v52.7,24.51 | R9.1 57.14,18.09 v58.13,18.09 | 3.GND 56.47,6.8 55.58,7.69 55.58,8.4 55.28,8.7 R13.1 | v50.31,23.19 50.85,23.19 v51.46,22.57
  Bottom 0.152: TH.GND 60.2,16.06 58.66,17.6 58.66,18.62 | 58.66,18.62 58.66,19.06 58.89,19.29 v58.89,20.38 58.89,23.19 58.94,23.24 | v59.03,24.29 59.03,23.27 58.99,23.24 58.94,23.24 | 51.77,24.65 v50.31,23.19 50.31,21.38 | 51.77,24.65 51.78,24.66 52.55,24.66 v52.7,24.51 | 50.31,21.38 50.31,19.83 v50.38,19.76 51.17,18.97 U$18.3 | v50.17,4.24 50.17,5.57 v50.95,6.35 | v50.95,6.35 54.06,6.35 54.53,5.87 | 54.53,5.87 55.15,5.25 55.15,3.32 | 55.15,3.32 v55.15,1.52 57.47,3.83 57.47,6.72 | v67.06,20.67 67.06,17.88 65.25,16.07 | v58.13,18.09 58.66,18.62 | 50.31,21.38 50.41,21.27 U$14.3 53.23,21.27 53.4,21.1 53.4,19.57 54.16,18.81 54.34,18.81 54.6,18.56 54.6,18.51 C18.1 | IC2.2 58.8,25.39 59.17,25.02 59.17,24.82 59.03,24.68 v59.03,24.29 | 61.38,26.19 C20.2 61.22,26.04 60.32,25.14 59.57,25.14 59.23,24.79 59.23,24.49 v59.03,24.29 | C19.1 55.85,20.35 54.54,20.35 54.19,20.7 54.19,24.86 54.87,25.53 v55.54,25.53 | 3.GND 57.47,6.72 | C21.2 57.56,23.24 58.94,23.24 | v53.48,5.56 53.79,5.87 54.53,5.87 | v55.95,3.82 55.46,3.32 55.15,3.32 | v62.65,1.32 62.65,6.32 1.GND 63.35,7.02 v67.85,7.02 | v67.85,15.27 67.85,13.98 67.6,13.72 | C22.2 51.12,25.31 51.77,24.65 | C23.2 52.5,13.27 52.5,8.92 52.2,8.62 50.4,8.62 50,8.22 50,7.29 v50.95,6.35 | U$8.3 55.05,7.77 55.7,7.12 57.07,7.12 57.47,6.72
  Bottom 1.27: TH.GND ST.GND 65.25,16.07 67.6,13.72 67.6,9.92 64.48,6.8 1.GND 2.GND 3.GND
  pour Bottom (rank 6): 48.9,27.32 51.1,29.52 69.6,29.52 71.2,27.92 71.2,-0.78 69.2,-2.78 54.9,-2.78 48.9,3.22
  pour Top (rank 6): 46.05,24.77 46.05,28.92 48.05,30.92 69.35,30.92 72.4,27.87 72.4,-0.63 69.7,-3.33 54.05,-3.33 53.95,-3.23 48.7,2.02 48.7,21.72 46.05,24.37
GND2  (via drill 0.35)
  Top 0.152: MDBT1.33 21.5,11.45 C10.1 | 16.41,5.42 16.41,5.29 C12.1 16.26,5.25 v15.28,6.23 | 16.41,5.42 C9.1 16.41,8.8 16.91,9.31 | U$12.1 25.98,1.91 24.77,0.69 21.05,0.69 20.78,0.96 v19.6,0.96 | 23.76,3.12 23.76,3.45 C8.1 22.95,4.32 21.47,4.32 21.02,4.77 21.02,5.85 21.33,6.16 21.8,6.16 | 21.8,6.16 IC1.2 | 16.91,9.31 C6.1 | 16.91,9.31 16.7,9.52 C7.1 11.32,9.52 10.78,10.06 10.78,12.13 11.4,12.75 MDBT1.15 10.49,14.16 | 10.49,14.16 10.27,14.38 6.83,14.38 SPI-LED.GND | 26.93,6.76 C5.1 28.61,6.73 C4.1 28.12,7.22 28.12,8.05 27.78,8.39 U$10.1 27.39,8.22 v26.1,8.22 26.1,7.59 26.93,6.76 | C10.1 22.68,11.14 v23.7,10.12 23.7,9.22 v23.9,9.02 23.9,7.92 v24,7.82 | C11.1 20.46,9.64 21.54,10.72 21.4,10.72 C10.1 | C14.2 40.07,8.51 41.5,8.51 | C13.2 41.5,8.51 | 39.5,18.82 39.5,18.22 40.69,17.04 U$16.5 43.1,17.04 | 39.5,18.82 R7.1 | 43.1,17.04 44.78,17.04 47,14.82 47,11.15 | 47,11.15 47,7.02 45.7,5.72 v43.1,5.72 | 40.1,8.72 C14.2 | R15.1 46.2,11.15 | 46.2,11.15 47,11.15 | C2.1 27.77,18.62 28.8,18.62 29.1,18.32 U$2.1 29.1,16.92 29.3,16.72 29.6,16.72 29.75,16.87 U$2.2 29.75,18.37 30,18.62 30.5,18.62 | ..6 21.49,23.51 MDBT1.55 19.53,23.65 18.1,22.22 17.2,22.22 | 12.1,22.55 12.67,22.55 13,22.22 13.1,22.22 | 12.1,22.55 MDBT1.2 11.55,23.05 C17.1 | 17.2,22.22 13.2,22.22 | 13.2,22.22 13.1,22.22 | C17.1 10.26,22.81 9.94,22.49 U$5.4 | C17.1 10.6,23.05 10.6,22.32 v11.1,21.82 | MDBT1.1 12.1,23.6 12.1,22.55 | U$5.3 9.94,16.82 9.8,16.68 9.8,16.62 v9.3,16.12 | 31.7,21.92 31.2,21.92 31.05,22.07 U$2.25 | 31.7,21.92 32,21.92 | 32,21.92 32.4,22.32 32.4,23.33 U$2.23 | 32.07,18.89 31.8,18.62 31.6,18.62 | 32.07,18.89 32.35,19.17 | 32,21.92 32.2,21.72 32.2,19.32 32.35,19.17
  Top 0.152: v34.1,15.92 34.12,15.91 U$3.8 | v35.1,18.52 33,18.52 32.35,19.17 | v26.2,10.72 26.2,11.36 C3.1 25.7,12.36 U$17.3 25.84,13.22 29.9,13.22 30.27,12.85 C1.1 | 41.5,8.51 41.6,8.61 41.6,10.91 C16.1 41.06,13.05 R19.2 | C14.2 39.8,8.78 v39.8,10.22 | 16.1,5.11 16.28,5.29 | 16.28,5.29 16.41,5.42 | v39.9,2.02 40.9,2.02 41.96,3.08 R24.1 R18.2 42.33,5.72 v43.1,5.72 | R20.2 38.15,16.47 38.54,16.87 38.54,17.55 38.6,17.61 38.6,18.22 39.2,18.82 39.5,18.82 | v35.1,18.52 35.1,20.22 v35.5,20.62 | 43.1,17.04 45,18.94 v45,19.52 45,21.32 v45.5,21.82 | R5.1 39.18,21.42 v38.4,21.42 | v20.8,6.62 21.34,6.62 21.8,6.16 | v16.9,2.62 16.28,3.24 16.28,5.29 | 12.56,5.15 R25.1 13.82,3.72 v15.4,3.72 | v31.26,19.27 31.68,19.27 32.07,18.89 | v13.2,21.12 13.2,22.12 13.1,22.22 | v13.3,23.02 13.3,22.32 13.2,22.22 | v17.7,23.12 17.7,22.72 17.2,22.22 | v45.3,15.12 v45.3,13.82 46.2,12.92 46.2,11.15 | v35.5,20.62 35.4,20.72 v35.4,22.02 | v35.4,22.02 35.3,21.92 v33.9,21.92 | v35.4,22.02 35.5,22.12 v36.8,22.12 | v9.81,5.4 10.51,5.4 v11.11,4.8 | v44.69,3.92 43.1,5.51 v43.1,5.72 | v33.9,19.52 33.12,20.3 v33.12,20.9 | v36,19.42 35.5,19.92 v35.5,20.62 | v8.59,9.12 8.59,10.97 v8.4,11.16 | v10.49,13.32 10.49,14.16 | v26.1,5.62 26.93,6.46 26.93,6.76 | U$2.24 31.7,21.92 | 30.5,18.62 31.1,18.62 | 31.1,18.62 31.6,18.62 | U$2.3 30.4,18.52 30.5,18.62 | U$2.4 31.05,18.57 31.1,18.62 | U$2.5 31.7,18.52 31.6,18.62 | v35.1,18.52 37.4,18.52 37.55,18.37 U$2.14
  Top 0.254: U$17.3 25.7,14.13 v25.82,14.25 | C8.1 24.41,3.48 25.98,1.91 | U$12.1 26.07,2.79 26.4,3.12 29.1,3.12 v29.4,3.42
  Bottom 0.152: v23.7,10.12 24.2,10.12 v26.1,8.22 26.1,10.62 v26.2,10.72 | v34.1,15.92 34.1,17.52 v35.1,18.52 | v39.8,10.22 43.1,6.92 v43.1,5.72 | v11.1,21.82 10.2,21.82 8.7,20.32 8.7,16.72 v9.3,16.12 9.3,16.02 7.57,14.29 SPI-LED.GND 3.98,14.29 v3.63,13.95 | v29.4,3.42 38.5,3.42 v39.9,2.02 40.2,2.02 v41,1.22 42.2,1.22 v42.8,1.82 42.97,1.99 v44.24,1.99 | v19.6,0.96 16.3,0.96 16.3,2.02 v16.9,2.62 | v35.5,20.62 37.9,20.62 | 37.9,20.62 43.9,20.62 v45,19.52 43.81,18.33 v42.8,18.33 | v38.4,21.42 38.4,21.12 37.9,20.62 | v25.82,14.25 28.13,14.25 31.26,17.38 v31.26,19.27 | v23,20.22 22.2,21.02 20.3,21.02 19.7,21.62 19,21.62 17.7,22.92 v17.7,23.12 | v13.2,21.12 v15.2,21.12 v17.3,21.12 | v6.07,1.28 7.31,2.52 v8.8,2.52 8.8,4.64 v8.59,4.85 9.26,4.85 v9.81,5.4 10.89,6.48 v10.89,6.52 | v10.89,6.52 11.19,6.23 v15.28,6.23 15.4,6.11 v15.4,3.72 | v20.8,6.62 15.5,11.92 15.5,13.91 v14.79,14.62 14.39,15.02 11.3,15.02 9.49,13.21 v9.49,12.52 9.49,12.25 v8.4,11.16 | v8.59,9.12 10.89,6.82 v10.89,6.52 | v33.12,20.9 33.12,21.14 v33.9,21.92 | v0.98,15.94 1.26,16.22 v2.72,16.22 3.63,15.3 v3.63,13.95 | v3.63,13.95 3.63,10.96 v3.54,10.88 3.54,8.13 3.71,7.97 | 3.71,7.97 v3.72,7.95 | v1.18,6.94 2.21,7.97 3.71,7.97
  pour Top (rank 6): -2.1,27.32 1.4,30.82 42.3,30.82 44.3,28.82 44.3,24.22 47.1,21.42 47.1,3.72 40,-3.38 1,-3.38 -2.1,-0.28
  pour Bottom (rank 6): -2.71,26.66 1.42,30.79 42.38,30.79 44.59,28.58 44.59,24.39 44.58,24.38 47.23,21.72 47.23,15.43 47.29,15.37 47.29,3.57 40.17,-3.54 0.7,-3.54 -2.71,-0.13
MOSI  (via drill 0.35)
  Top 0.152: MDBT1.61 18.7,18.92 18.5,18.72 16.2,18.72 13.2,15.72 10.3,15.72 v10.2,15.62 | v8.4,13.52 8.17,13.29 5.7,13.29 5.37,12.97 5.37,8.78 5.85,8.29 SPI-LED.DI
  Bottom 0.152: v10.2,15.62 10.2,15.32 v8.4,13.52
N$2
  Top 0.152: U$2.6 32.35,16.64 R3.2
N$3
  Top 0.152: U$2.7 32.94,17.47 R3.1
N$4  (4 unrouted)
  Top 0.152: VM_CN1.T3 30.4,3.43 VM_CN1.T1 | VM_CN1.T3 30.09,1.91 | VM_CN1.T3 30.9,1.6 | VM_CN1.T5 35.3,1.6 | VM_CN1.B2 37.6,3.43 37.6,1.62 VM_CN1.T6
  Top 0.406: VM_CN1.5 35.3,1.75 VM_CN1.T5
  Top 1.27: U$12.2 30.59,1.91 30.9,1.6 | VM_CN1.T3 VM_CN1.T4 VM_CN1.T5 37.58,1.6 37.6,1.62
N$5
  Top 0.152: R4.2 41.45,23.34 U$15.1
N$6
  Top 0.152: C9.2 19.55,7.04 IC1.4
N$7
  Top 0.152: U$15.8 53.66,23.58 55.47,23.58 C15.1 | C15.1 55.85,24.09 | U$1.C 55.68,23.8 C15.1
N$8  (via drill 0.35)
  Top 0.152: U$11.2 25.26,5.23 C5.2 25.11,6.88 25.11,6.51 C8.2 23.64,5.18 | 23.64,5.18 22.25,5.18 IC1.1 | 23.64,5.18 23.64,6.76 23.29,7.11 IC1.3 22.11,7.22 22.11,7.92 v21.92,8.12 | U$13.C 21.3,8.32 21.5,8.12 v21.92,8.12 | v20.26,13.68 20.7,13.24 MDBT1.32 | C10.2 21.81,8.26 21.79,8.24 v21.92,8.12
  Bottom 0.152: v21.92,8.12 21.92,12.02 v20.26,13.68
N$9
  Top 0.152: R4.1 38.79,23.01 36.8,21.02 36.8,20.12 38.1,18.82 38.1,17.12 37.3,16.32 37.3,15.12 37.1,14.92 36.9,14.92 36.71,14.73 U$3.4
N$10
  Bottom 0.152: U$8.2 55.26,8.72 D4.C
N$11
  Bottom 0.152: D4.A 56.36,11.82 57.41,11.82 3.I/O
N$12  (via drill 0.35)
  Top 0.152: v55.6,6.32 55.2,6.72 55.2,6.82 54.83,7.19 R12.1
  Bottom 0.152: U$8.4 51.85,6.92 55,6.92 v55.6,6.32
N$14  (via drill 0.35)
  Top 0.152: R6.1 38.63,20.29 38.6,20.32 v38.2,19.92 | v35.1,15.42 34.76,15.08 U$3.7
  Bottom 0.152: v38.2,19.92 38.2,18.82 35.2,15.82 35.2,15.52 v35.1,15.42
N$15  (via drill 0.35)
  Top 0.152: v36.6,8.82 36.8,8.82 38.01,7.61 U$3.15 38.01,5.91 38.2,5.72 38.2,4.52 38.9,3.82 40.03,3.82 R24.2 | MDBT1.4 10.73,20.15 v10.6,20.02
  Bottom 0.152: v36.6,8.82 32.47,12.95 24.57,12.95 21.4,16.12 16.8,16.12 16.5,16.42 14.5,16.42 13.8,15.72 11.7,15.72 9.9,17.52 9.9,18.82 10.6,19.52 v10.6,20.02
N$16
  Top 0.152: R5.2 41.52,22.07 U$15.2
N$17
  Top 0.152: R6.2 41.66,20.8 U$15.3
N$18
  Top 0.152: R7.2 41.85,19.53 U$15.4
N$20
  Top 0.152: C7.2 13.17,11.22 CY1.P$2 13.5,11.29 MDBT1.17
N$21
  Top 0.152: C6.2 15.74,11.13 CY1.P$1 15.09,10.91 14.3,11.7 MDBT1.18
N$22
  Top 0.152: MDBT1.31 20,12.65 20,11.27 L1.2
N$23  (via drill 0.35)
  Top 0.152: R8.2 56.55,15.72 v56.74,15.91 | 53.41,13.21 U$16.1 53.55,13.35 54.07,13.35 55.8,11.62 55.8,11.02 56.2,10.62 58.5,10.62 v59,11.12
  Bottom 0.152: 56.74,14.88 v56.74,15.91 57.13,15.52 58.96,15.52 60.09,14.39 60.09,13.6 59,12.51 v59,11.12
N$24
  Top 0.152: 53.63,14.71 U$16.2 53.66,14.73 54.26,14.73 55.07,15.55 55.07,16.02 R9.2
N$25
  Top 0.152: 53.45,15.8 U$16.3 53.66,16.01 54.22,16.01 54.66,16.45 54.66,17.55 R10.2
N$26
  Top 0.152: 53.42,17.1 U$16.4 53.42,18.19 53.82,18.59 54.44,18.59 55.06,19.22 55.06,19.9 55.15,19.99 R11.2 | 53.42,17.1 53.42,17.33 | 53.68,17.1 53.42,17.1
N$27  (via drill 0.35)
  Top 0.152: v51.2,10.68 51.85,10.68 52.12,10.95 53.8,10.95 D1.C
  Bottom 0.152: 51.62,17.02 U$18.2 50.41,17.02 49.99,16.59 49.99,15.7 50.33,15.36 50.33,13.79 50.62,13.5 50.62,12.48 51.64,11.46 51.64,11.13 v51.2,10.68
N$28  (via drill 0.35)
  Top 0.152: R10.1 56.03,19.06 56.21,19.23 57.82,19.23 v58.12,19.53
  Bottom 0.152: U$14.4 55.13,21.42 55.74,22.03 57.36,22.03 57.72,21.68 57.72,19.93 v58.12,19.53
N$29  (via drill 0.35)
  Top 0.152: v55.31,14.64 55.35,14.6 R8.1
  Bottom 0.152: U$18.4 53.38,17.97 52.72,17.31 52.72,15.46 53.52,14.66 53.98,14.66 | 53.98,14.66 54,14.66 | 53.98,14.66 54.01,14.64 v55.31,14.64
N$30
  Top 0.152: U7.1 51.59,8.34 R12.2 52.73,7.25 53.53,8.05 53.53,9.53 54.04,10.04 R14.2
N$31
  Top 0.152: U7.2 51.67,9.81 52.7,9.81 | R13.2 52.7,8.7 52.7,9.81 | R14.1 52.7,10.03 52.7,9.81
N$32
  Top 0.152: U$16.7 42.59,14.72 R16.1
N$33
  Top 0.152: R17.1 42.53,16.05 U$16.6
N$34  (via drill 0.35)
  Top 0.152: v30.4,10.92 30.5,11.02 31.4,11.02 31.84,11.46 R1.1 | v16.1,15.52 16.1,15.32 15.5,14.72 MDBT1.21
  Bottom 0.152: v30.4,10.92 28.9,12.42 24.1,12.42 20.8,15.72 16.3,15.72 v16.1,15.52
N$35  (via drill 0.35)
  Top 0.152: v37.8,10.62 38.66,11.48 U$3.1 | v13.7,18.72 13.18,18.72 MDBT1.7 | R18.1 40.43,5.52 40.9,5.52 41.1,5.72 v41.1,6.52
  Bottom 0.152: v41.1,6.52 37.8,9.82 v37.8,10.62 37.6,10.42 36,10.42 32.91,13.51 24.74,13.51 21.73,16.52 17.5,16.52 16.9,17.12 14.7,17.12 14.5,16.92 14.1,16.92 13.7,17.32 v13.7,18.72
N$36
  Top 0.152: PWR.CATHODE 14.09,6.51 R25.2
N$37
  Top 0.152: R3.7 32.2,14.76 32.2,13.22 33.9,11.52 36.6,11.52 37.36,12.28 U$3.3
N$38
  Top 0.152: R3.8 33,14.76 33,13.22 34.1,12.12 34.9,12.12 35.41,12.63 U$3.6
N$39
  Top 0.152: PAIR.CATHODE R26.2
N$40  (via drill 0.35)
  Top 0.152: MDBT1.3 12.05,21.35 11.52,20.82 9.9,20.82 9.6,20.52 8.25,20.52 v8.18,20.59 | 6.18,18.2 R26.1 5.95,17.87 5.5,17.42 5.5,17.22 v4.4,16.12
  Bottom 0.152: v8.18,20.59 7.78,20.59 4.4,17.21 v4.4,16.12
N$41
  Top 0.152: MODE.CATHODE 4.48,20.1 R27.2
N$42
  Top 0.152: U$17.2 23.41,18.15 22.15,18.15 21.35,17.35 MDBT1.41
N$43  (via drill 0.35)
  Top 0.152: R27.1 6.2,21.02 v7.1,21.92 | MDBT1.43 20.07,18.15 19.3,18.92 v19.3,20.72
  Bottom 0.152: v7.1,21.92 8.3,23.12 10.8,23.12 11.7,22.22 17.3,22.22 18.8,20.72 v19.3,20.72
N$44  (via drill 0.35)
  Top 0.152: R2.1 31.42,9.32 v30.79,9.95 | MDBT1.23 16.3,14.32 16.6,14.62 v16.7,14.62
  Bottom 0.152: v30.79,9.95 30.24,9.95 28.47,11.72 24,11.72 20.4,15.32 17.4,15.32 v16.7,14.62
N$45
  Top 0.152: D1.A 50.9,11.6 49.94,10.65 49.94,7.96 50.79,7.12 51.29,7.12 52.16,6.25 52.16,5.45 52.84,4.77 54.4,4.77 55.03,5.4 55.55,5.4 56.08,4.86 61.5,4.86 61.87,5.23 61.87,10.61 1.I/O
N$46
  Top 0.152: D2.A 58.13,13.69 59.95,11.87 2.I/O
N$47  (via drill 0.35)
  Top 0.152: D2.C 58.93,15.79 58.93,15.24 59.35,14.81 v59.35,13.95
  Bottom 0.152: U$14.2 51.85,20.32 51.51,19.97 51.51,19.03 52.06,18.48 52.06,14.97 54.15,12.88 55.7,12.88 56.25,13.42 58.82,13.42 v59.35,13.95
N$49
  Bottom 0.152: C21.1 55.07,23.27 IC2.4
N$50
  Bottom 0.152: IC2.1 57.64,26.37 | IC2.3 56.91,24.44 56.61,24.74 56.61,25.9 57.08,26.37 57.64,26.37 | 57.64,26.37 57.99,26.37 58.02,26.35 C20.1 59.52,26.91 59.84,27.22 62.28,27.22 62.59,26.91 62.59,24.2 D3.C
N$51
  Bottom 0.152: 56.51,19.41 55.18,19.41 U$14.5 54.49,19.37 53.8,20.06 53.8,25.07 IC2.5 52.02,26.34 C22.1 50.09,26.51 49.4,25.82 49.4,14.67 C23.1 49.45,10.97 50.75,9.67 U$8.5 | 56.51,19.41 C19.2 | U$18.5 53.78,16.05 C18.2 55.78,16.48 56.16,16.48 56.67,16.99 56.67,19.25 56.51,19.41
P0.09  (via drill 0.35)
  Top 0.152: ..5 25.61,23.51 25.8,23.32 26.9,23.32 v27,23.42 | v19.4,22.52 19.77,22.15 MDBT1.52
  Bottom 0.152: v27,23.42 26.7,23.12 20,23.12 v19.4,22.52
P0.11  (via drill 0.35)
  Top 0.152: v18.02,17.16 17.9,17.04 MDBT1.27 | ..3 26.22,22.24 v26.4,22.42 | v22.8,17.42 23.92,16.3 v25.85,16.3
  Bottom 0.152: v26.4,22.42 26.4,16.85 v25.85,16.3 | v18.02,17.16 18.02,17.36 18.62,17.96 21.96,17.96 22,17.92 22.3,17.92 v22.8,17.42
RCH1
  Top 0.152: U$15.7 53.73,22.38 | U$15.7 53.47,22.12 | ST.I/O 62.99,21.73 62.07,22.65 59.37,22.65 59.01,22.29 59.01,21.95 58.72,21.66 54.5,21.66 54.09,22.07 U$15.7
RCH2
  Top 0.152: 53.66,21.05 U$15.6 53.85,21.24 60.3,21.24 TH.I/O
RESET
  Top 0.152: 8.22,21.4 U$5.2 8.67,21.85 8.7,21.88 | 8.22,21.4 8.18,21.36 | 8.3,23.05 C17.2 | 8.22,21.4 7.98,21.4 7,20.42 7,16.62 8.73,14.89 13.2,14.89 16.66,18.35 19.07,18.35 19.8,17.62 19.8,16.92 20.17,16.55 MDBT1.40
  Top 0.305: R23.1 7.64,23.05 C17.2 8.67,22.94 8.67,21.85
SCK  (via drill 0.35)
  Top 0.152: v12.4,13.82 12.9,13.82 17,17.92 18.3,17.92 19.03,17.19 v19.07,17.19 | v23.6,15.72 23.23,15.35 MDBT1.37
  Bottom 0.152: v12.4,13.82 12.4,13.72 8.97,10.29 SPI-LED.CI | v19.07,17.19 22,17.19 22.82,16.37 22.96,16.37 v23.6,15.72
SCL  (via drill 0.35)
  Top 0.152: v30.9,20.52 30.9,21.22 30.4,21.72 U$2.26 | v14.5,18.02 14.5,17.62 14.23,17.35 MDBT1.11 | R22.1 27.07,14.15 26.26,14.96 25.03,14.96 v24.75,15.25 24.12,14.62 23.01,14.62 TP2.TP
  Bottom 0.152: v30.9,20.52 30.9,20.42 29,18.52 29,16.52 27.43,14.96 25.04,14.96 v24.75,15.25 24.75,15.47 23.6,16.62 23.6,17.52 22.2,18.92 14.8,18.92 14.5,18.62 v14.5,18.02
SDA  (via drill 0.35)
  Top 0.152: U$2.27 29.75,21.17 v29.6,21.02 | v26.6,15.62 26.67,15.55 R21.1 27.66,16.05 27.02,16.69 TP1.TP | MDBT1.12 11.37,16.95 11,17.32 v11,18.12
  Bottom 0.152: v29.6,21.02 27.5,18.92 27.5,16.52 v26.6,15.62 26.5,15.52 25.5,15.52 24.5,16.52 24.5,17.62 22.3,19.82 12.7,19.82 v11,18.12
SWCLK
  Top 0.152: ..4 22.38,22.24 22.07,22.55 MDBT1.53
SWDIO
  Top 0.152: ..2 23.89,21.07 22.88,21.07 22.2,21.75 MDBT1.51
VIN  (via drill 0.35)
  Top 0.152: U$1.A 58.14,22.71 58.45,22.71 58.85,23.12 61.48,23.12 | 61.48,23.12 63.17,23.12 64.34,21.94 64.34,19.97 ST.VCC | v61.88,25.07 61.48,24.67 61.48,23.12
  Top 1.27: 1.VCC 63.77,9.34 65.1,10.67 65.1,17.47 63.96,18.61 ST.VCC TH.VCC
  Bottom 0.152: D3.A 60.81,24 v61.88,25.07
  Bottom 1.27: 1.VCC 2.VCC 3.VCC
  pour Bottom (no thermals): 59.39,17.94 59.39,18.8 60.2,19.61 63.99,19.61 64.25,19.35 64.25,18.29 63.49,17.53 59.81,17.53
  pour Bottom (no thermals): 56.51,8.75 56.51,9.79 56.87,10.15 64.55,10.15 64.65,10.05 64.65,8.59 64.47,8.4 56.85,8.4 56.49,8.75

### Text on the board
tPlace: #615 | Designed in Aizu | REV 1.0.4
bPlace: S/N | F-615-1-4-A-N-J-0-P
tDocu: MDBT50 | CUS05F040 | DEBUG | TLP2270 | GREEN | PCA9685PW | BT | BLUE | RESET | TLP2270 | 32kHz | MC74HC157A | PRTR5V0U2X | CUS05F040 | RED | LP2985-33